# EasyEDA Pro project STM32F103RCT6核心板2.0.epro

# Schematic Schematic3
Create Date: 2024-05-28; Page Name: P1; Project Name: 飞行器协会; Schematic Name: Schematic3; Update Date: 2024-05-30; Company: 嘉立创EDA; Page Size: A4; Version: V1.0
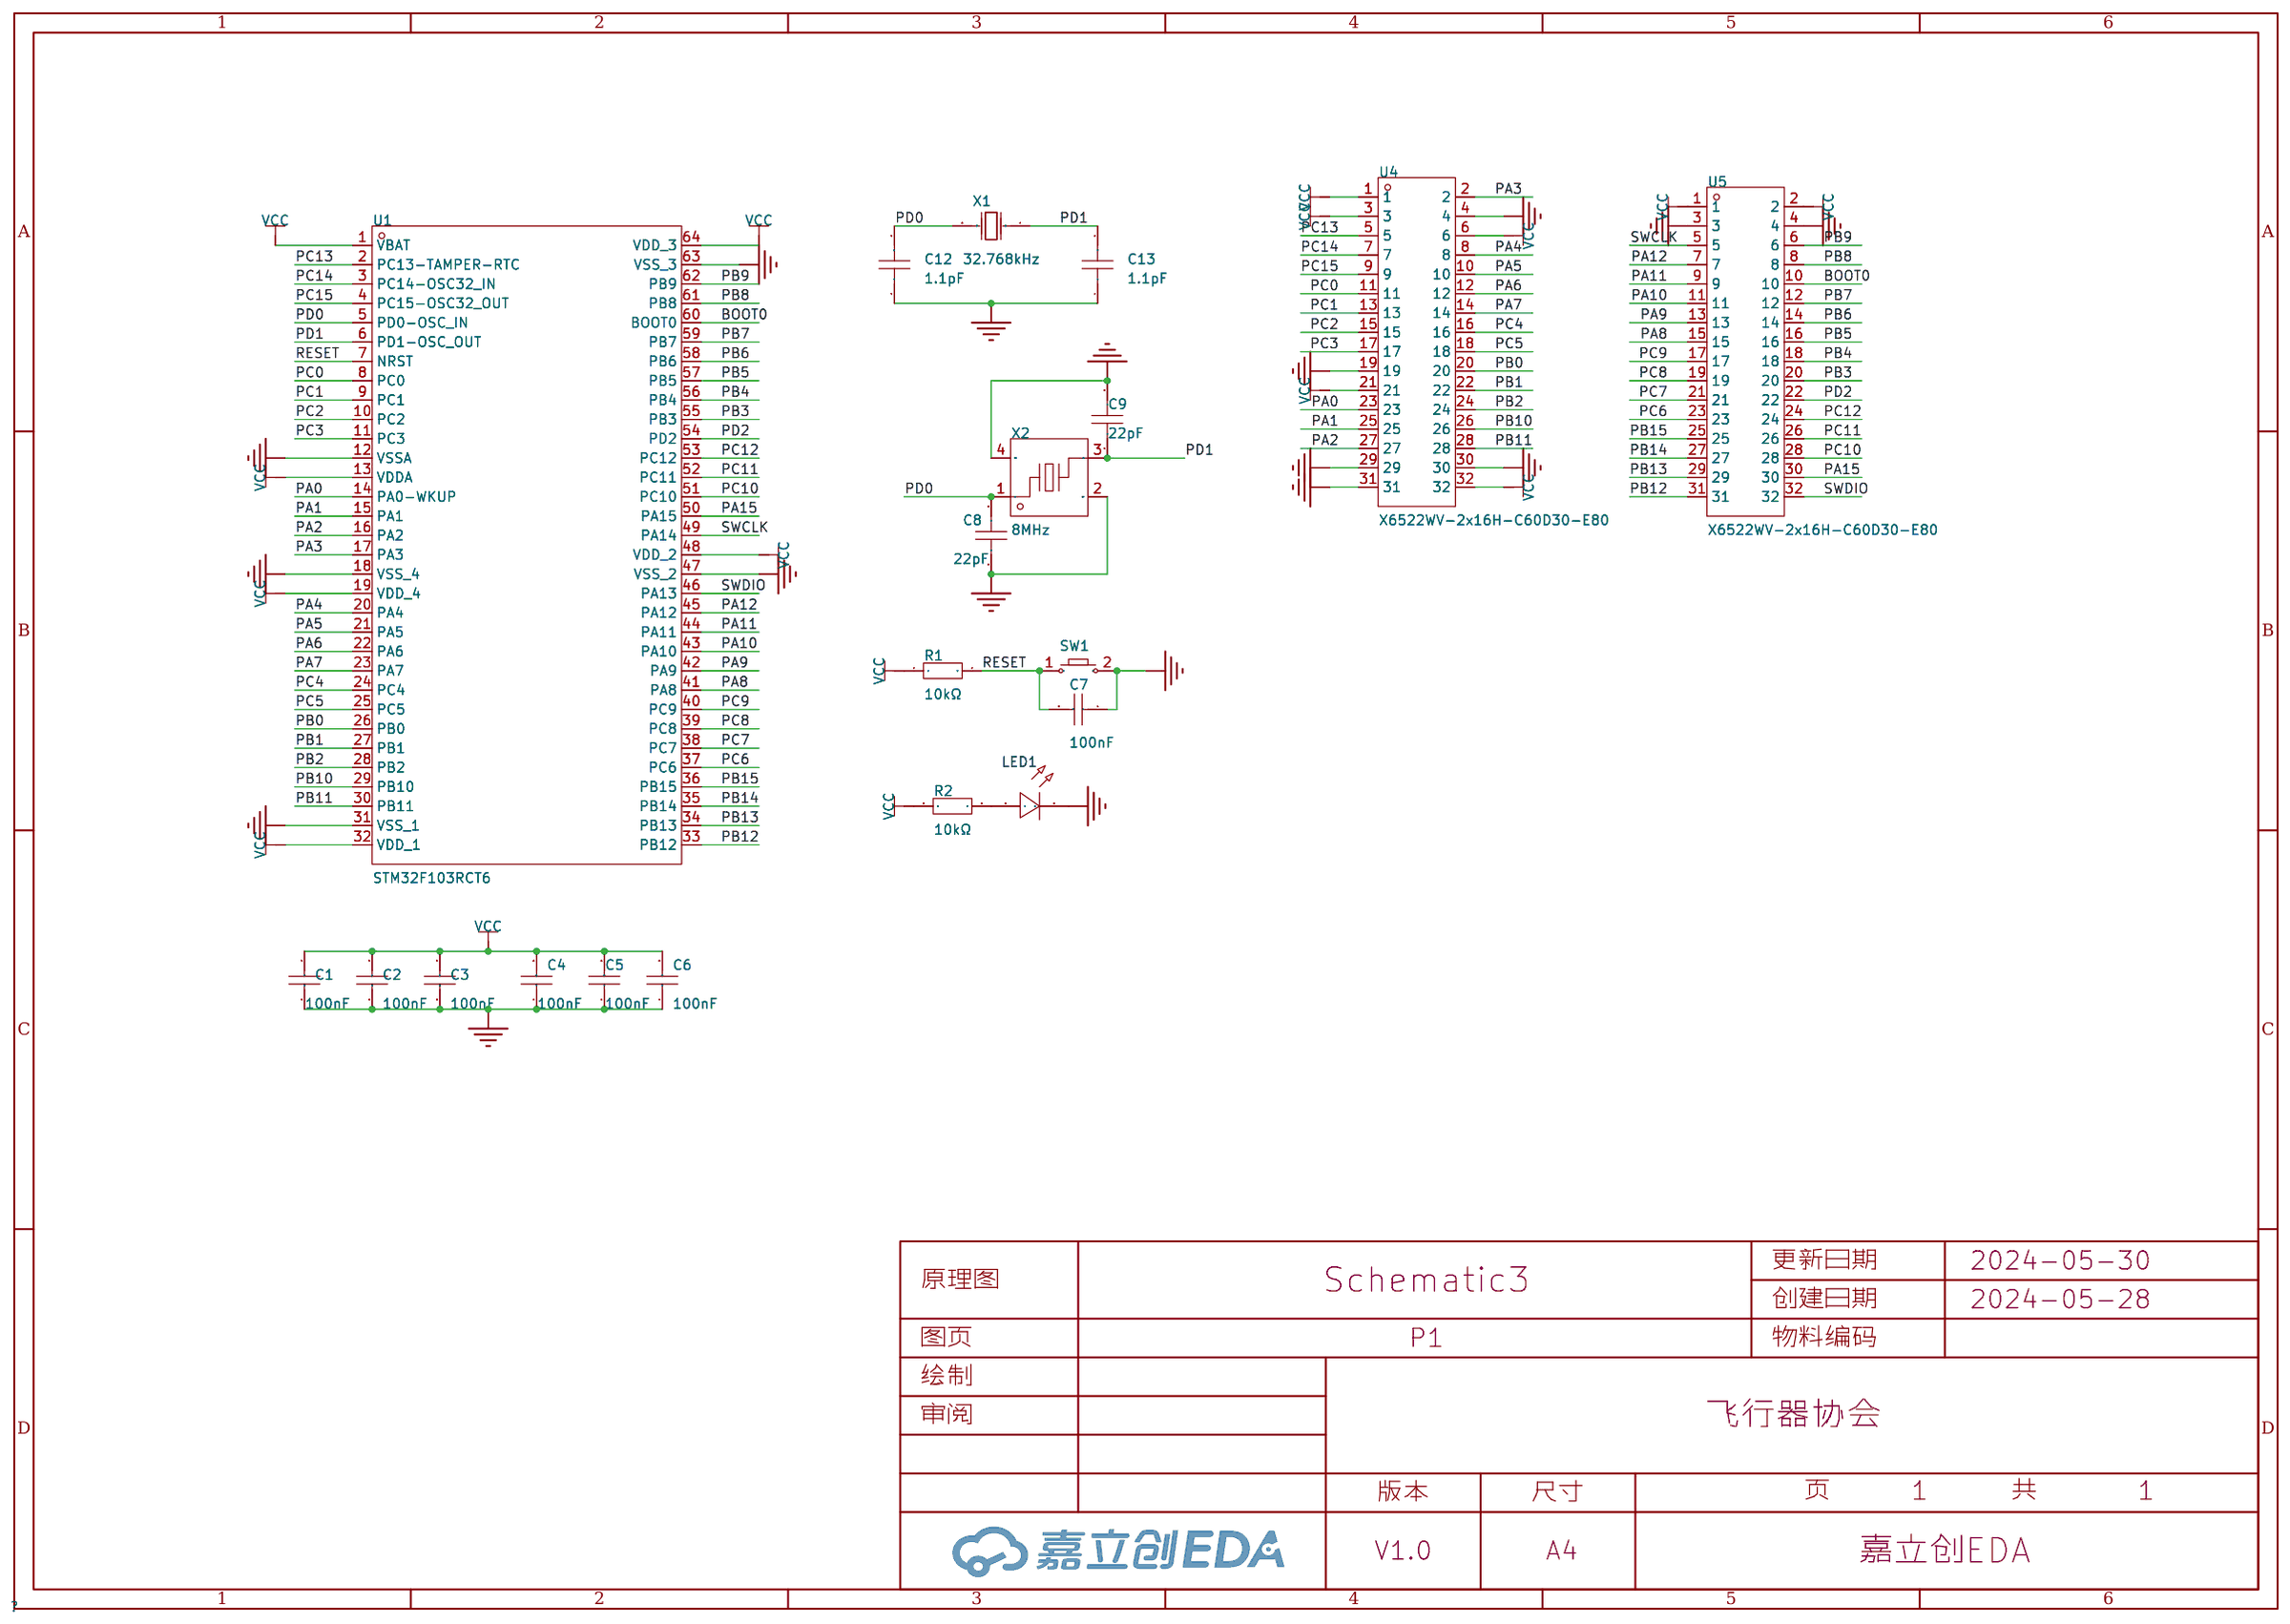
[diagram p0: schematic sheet]

## Parts
C1  100nF  [C0805]
C2  100nF  [C0805]
C3  100nF  [C0805]
C4  100nF  [C0805]
C5  100nF  [C0805]
C6  100nF  [C0805]
C7  100nF  [C0805]
C8  22pF  [C0805]
C9  22pF  [C0805]
C12  1.1pF  [C0805]
C13  1.1pF  [C0805]
LED1  -  [LED_0805]
R1  10kΩ  [R0805]
R2  10kΩ  [R0805]
SW1  -  [Key_SMD_3.6x6.1x2.5]
U1  STM32F103RCT6  [LQFP-64_L10.0-W10.0-P0.50-LS12.0-BL]
U4  X6522WV-2x16H-C60D30-E80  [HDR-TH_32P-P2.54-V-M-R2-C16-S2.54-3]
U5  X6522WV-2x16H-C60D30-E80  [HDR-TH_32P-P2.54-V-M-R2-C16-S2.54-3]
X1  32.768kHz  [OSC-TH_BD2.0-P0.70-D0.3]
X2  8MHz  [CRYSTAL-SMD_4P-L3.2-W2.5-BL]

## Library data of the parts
C1-C7 = CC0805KRX7R9BB104: 容值:100nF;精度:±10%;额定电压:50V;材质(温度系数):X7R;; LCSC Part Name: 100nF ±10% 50V; Supplier Part: C49678; Manufacturer: YAGEO(国巨); Supplier Footprint: 0805; JLCPCB Part Class: 基础库; Datasheet: https://atta.szlcsc.com/upload/public/pdf/source/20180224/C181747_15194369449651363981.pdf; Supplier: LCSC; Tolerance: ±10%; Voltage Rated: 50V; Temperature Coefficient: X7R
C8 C9 = 0805CG220J500NT: 容值:22pF;精度:±5%;额定电压:50V;材质(温度系数):C0G;; LCSC Part Name: 22pF ±5% 50V; Supplier Part: C24658; Manufacturer: FH(风华); Supplier Footprint: 0805; JLCPCB Part Class: 扩展库; Datasheet: https://atta.szlcsc.com/upload/public/pdf/source/20200305/C486355_26A10D38EF8C2A5C37091D0039909270.pdf; Supplier: LCSC; Tolerance: ±5%; Voltage Rated: 50V; Temperature Coefficient: C0G
C12 C13 = VJ0805D1R1CXPAC: 容值:1.1pF;额定电压:250V;材质(温度系数):C0G;; LCSC Part Name: 1.1pF 250V; Supplier Part: C2308480; Manufacturer: VISHAY(威世); Supplier Footprint: 0805; JLCPCB Part Class: 扩展库; Datasheet: https://atta.szlcsc.com/upload/public/pdf/source/20210429/BF4DD61B9900AD89BD8F9B4032699D18.pdf; Supplier: LCSC; Voltage Rated: 250V; Temperature Coefficient: C0G
LED1 = LED_0805-G: Supplier Footprint: 0805
R1 R2 = 0805W8F1002T5E_C17414: 电阻类型:厚膜电阻;阻值:10kΩ;精度:±1%;功率:125mW;最大工作电压:150V;温度系数:±100ppm/℃;; LCSC Part Name: 10kΩ ±1% 125mW 厚膜电阻; Supplier Part: C17414; Manufacturer: UNI-ROYAL(厚声); Manufacturer Part: 0805W8F1002T5E; Supplier Footprint: 0805; JLCPCB Part Class: 基础库; Datasheet: https://atta.szlcsc.com/upload/public/pdf/source/20200306/C422600_1E6D84923E4A46A82E41ADD87F860B5C.pdf; Supplier: LCSC; Type: 厚膜电阻; Tolerance: ±1%; Power(Watts): 125mW; Overload Voltage (Max): 150V; Temperature Coefficient: ±100ppm/℃; Operating Temperature Range: -55℃~+155℃
SW1 = Key_SMD_3.6x6.1x2.5: Supplier Footprint: SMD
U1 = STM32F103RCT6: CPU内核:ARM Cortex-M3;CPU最大主频:72MHz;工作电压范围:2V~3.6V;程序存储容量:256KB;程序存储器类型:FLASH;RAM总容量:48KB;GPIO端口数量:51;; Supplier Part: C8323; Manufacturer: ST(意法半导体); Supplier Footprint: LQFP-64(10x10); JLCPCB Part Class: Extended Part; Datasheet: https://atta.szlcsc.com/upload/public/pdf/source/20180207/C88442_15179953708671359491.pdf; Supplier: LCSC; CPU Core: ARM Cortex-M3; CPU Maximum Speed: 72MHz; Operating Voltage Range: 2V~3.6V; Program Storage Size: 256KB; Program Memory Type: FLASH; RAM Size: 48KB; GPIO Ports Number: 51; ADC (Bit): 12bit; DAC (Bit): 12bit; Universal Serial Bus: 有; Peripheral/Function: DMA；片载温度传感器；PWM; Watchdog: 有; Infrared Data Association: 有; Low-Voltage Detect: 有; Direct Memory Access: 有; Internal Oscillator: 有; Operating Temperature Range: -40℃~+85℃
U4 U5 = X6522WV-2x16H-C60D30-E80: 插针结构:2x16P;间距:2.54mm;行距:2.54mm;圆针/方针:方针;安装类型:-;排数:双排;总PIN位数:32P;额定电流:3A;额定电压:250V;配合针长度:6mm;塑高:2.5mm;端接针长度:3mm;触头材质:黄铜;触头镀层:金;工作温度范围:-40℃~+105℃;焊接温度(最大值):260℃;颜色:黑色;; LCSC Part Name: 2x16P 间距:2.54mm 方针; Supplier Part: C5242090; Manufacturer: XKB Connection(中国星坤); Supplier Footprint: 插件,P=2.54mm; JLCPCB Part Class: Extended Part; Datasheet: https://atta.szlcsc.com/upload/public/pdf/source/20221103/23C5907AD205635BEC14B32D152B61D5.pdf; Supplier: LCSC; Pin Structure: 2x16P; Pitch: 2.54mm; Row Spacing: 2.54mm; Circluar Pins/Square Pins: 方针; Number of Rows: 双排; Number of Pins: 32P; Current Rating (Max): 3A; Voltage Rating (Max): 250V; Length of Mating Pin: 6mm; Insulation Height: 2.5mm; Length of End Connection Pin: 3mm; Contact Material: 黄铜; Contact Plating: 金; Operating Temperature Range: -40℃~+105℃; Soldering Temperature(Max): 260℃; Color: 黑色
X1 = DT-26 32.768KHz: 晶振类型:-;频率:-;外接负载电容:-;; LCSC Part Name: 32.768KHz 12.5PF 20ppm; Supplier Part: C93229; Manufacturer: KDS(大真空); Supplier Footprint: DT-26; JLCPCB Part Class: 扩展库; Datasheet: https://atta.szlcsc.com/upload/public/pdf/source/20170103/1483440003252.pdf; Supplier: LCSC
X2 = 3225 8M 20PF 10PPM: 晶振类型:-;频率:8MHz;常温频差:±10ppm;外接负载电容:20pF;频率稳定度(全温):±30ppm;; LCSC Part Name: 8MHz ±10ppm 20pF; Supplier Part: C5181477; Manufacturer: SST(索斯特); Supplier Footprint: SMD3225-4P; JLCPCB Part Class: 扩展库; Datasheet: https://atta.szlcsc.com/upload/public/pdf/source/20220927/9FEBDC685A33E51679C27FBCC47D4DBA.pdf; Supplier: LCSC; Normal temperature Frequency Tolerance: ±10ppm; External load capacitor: 20pF; Frequency Stability(Full temperature range): ±30ppm; Operating Temperature: -40℃~+80℃

## Nets
GND: C1.1 C2.1 C3.1 C4.1 C5.1 C6.1 C7.1 C8.1 C9.2 C12.1 C13.1 LED1.1(C) SW1.2 U1.12(VSSA) U1.18(VSS_4) U1.31(VSS_1) U1.47(VSS_2) U1.63(VSS_3) U4.4 U4.19 U4.29 U4.30 U4.31 U5.3 U5.4 X2.2(GND) X2.4(GND)
VCC: C1.2 C2.2 C3.2 C4.2 C5.2 C6.2 R1.1 R2.1 U1.1(VBAT) U1.13(VDDA) U1.19(VDD_4) U1.32(VDD_1) U1.48(VDD_2) U1.64(VDD_3) U4.1 U4.3 U4.6 U4.21 U4.32 U5.1 U5.2
BOOT0: U1.60(BOOT0) U5.10
PA0: U1.14(PA0-WKUP) U4.23
PA1: U1.15(PA1) U4.25
PA2: U1.16(PA2) U4.27
PA3: U1.17(PA3) U4.2
PA4: U1.20(PA4) U4.8
PA5: U1.21(PA5) U4.10
PA6: U1.22(PA6) U4.12
PA7: U1.23(PA7) U4.14
PA8: U1.41(PA8) U5.15
PA9: U1.42(PA9) U5.13
PA10: U1.43(PA10) U5.11
PA11: U1.44(PA11) U5.9
PA12: U1.45(PA12) U5.7
PA15: U1.50(PA15) U5.30
PB0: U1.26(PB0) U4.20
PB1: U1.27(PB1) U4.22
PB2: U1.28(PB2) U4.24
PB3: U1.55(PB3) U5.20
PB4: U1.56(PB4) U5.18
PB5: U1.57(PB5) U5.16
PB6: U1.58(PB6) U5.14
PB7: U1.59(PB7) U5.12
PB8: U1.61(PB8) U5.8
PB9: U1.62(PB9) U5.6
PB10: U1.29(PB10) U4.26
PB11: U1.30(PB11) U4.28
PB12: U1.33(PB12) U5.31
PB13: U1.34(PB13) U5.29
PB14: U1.35(PB14) U5.27
PB15: U1.36(PB15) U5.25
PC0: U1.8(PC0) U4.11
PC1: U1.9(PC1) U4.13
PC2: U1.10(PC2) U4.15
PC3: U1.11(PC3) U4.17
PC4: U1.24(PC4) U4.16
PC5: U1.25(PC5) U4.18
PC6: U1.37(PC6) U5.23
PC7: U1.38(PC7) U5.21
PC8: U1.39(PC8) U5.19
PC9: U1.40(PC9) U5.17
PC10: U1.51(PC10) U5.28
PC11: U1.52(PC11) U5.26
PC12: U1.53(PC12) U5.24
PC13: U1.2(PC13-TAMPER-RTC) U4.5
PC14: U1.3(PC14-OSC32_IN) U4.7
PC15: U1.4(PC15-OSC32_OUT) U4.9
PD0: C8.2 C12.2 U1.5(PD0-OSC_IN) X1.2(OSC2) X2.1
PD1: C9.1 C13.2 U1.6(PD1-OSC_OUT) X1.1(OSC1) X2.3
PD2: U1.54(PD2) U5.22
RESET: C7.2 R1.2 SW1.1 U1.7(NRST)
SWCLK: U1.49(PA14) U5.5
SWDIO: U1.46(PA13) U5.32
$1N2509: LED1.2(A) R2.2

# Board PCB13
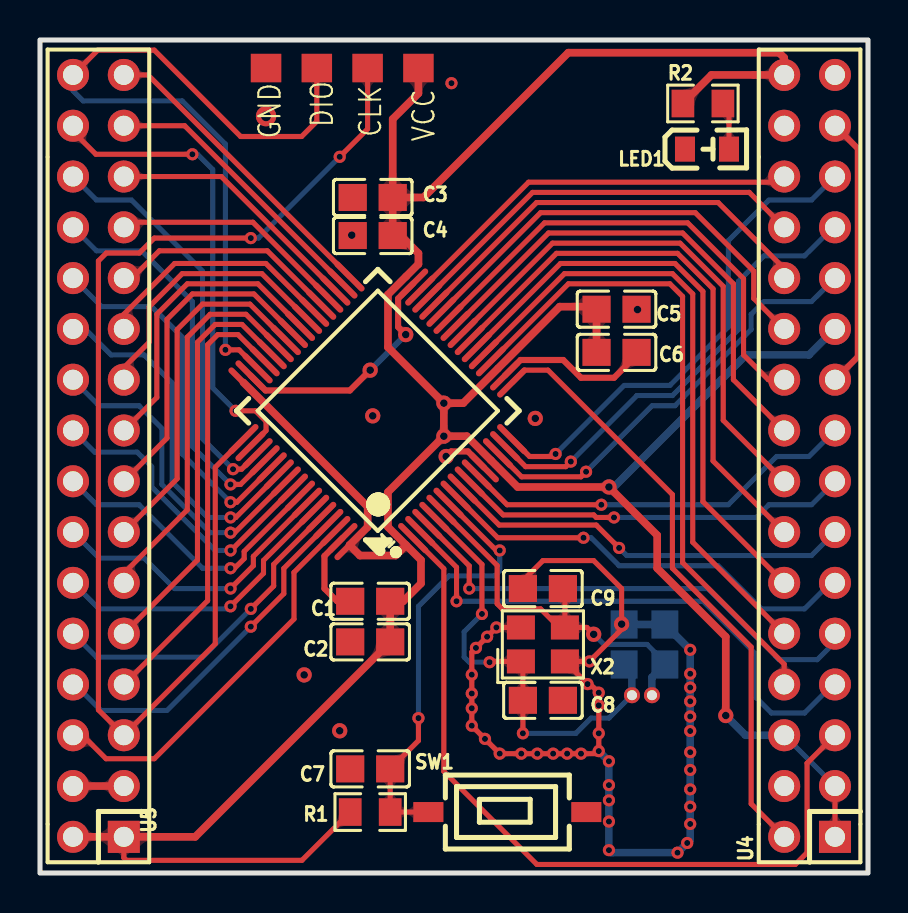
[diagram p1: board, top side]
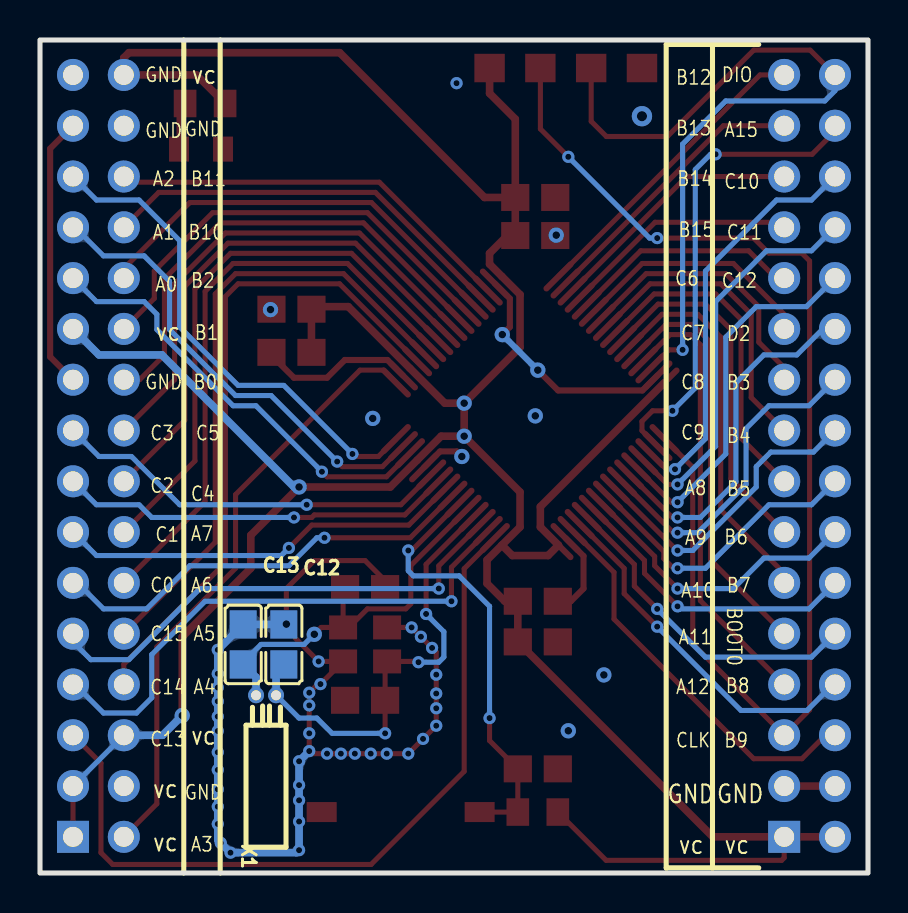
[diagram p2: board, bottom side, seen from below]

Outline 41.4 x 41.66 mm; copper layers: Top Layer, Bottom Layer. Coordinates in mm from the lower left corner of the outline.
Outline path: rectangle 0,41.66 41.4,0
Stack: Top Layer 0.035mm / Dielectric1 1.51mm FR4 er 4.5 / Bottom Layer 0.035mm

## Design rules (mm)
template: JLCPCB Capability(Two Layers Board)
spacing copperThickness1oz (default): track to track 0.102, other pairs 0.152 to 0.3
spacing copperThickness2oz: track to track 0.203, other pairs 0.152 to 0.3
track width copperThickness1oz (default): min 0.127, default 0.254, max 2.54
track width copperThickness2oz: min 0.203, default 0.254, max 2.54
differential pair differentialPair (default): width min 0.127, default 0.254, max 2.54; gap min 0.152, default 0.152
via viaSize (default): diameter min 0.5, default 0.61, max 10; hole min 0.3, default 0.305, max 6.3

## Placement (name value [footprint] x y rotation side)
C1  100nF  [C0805]  16.51 13.59 0 top
C2  100nF  [C0805]  16.51 11.56 0 top
C3  100nF  [C0805]  16.64 33.78 0 top
C4  100nF  [C0805]  16.64 31.88 0 top
C5  100nF  [C0805]  28.83 28.19 180 top
C6  100nF  [C0805]  28.83 26.03 180 top
C7  100nF  [C0805]  16.51 5.21 0 top
C8  22pF  [C0805]  25.15 8.64 180 top
C9  22pF  [C0805]  25.15 14.22 180 top
C12  1.1pF  [C0805]  29.21 11.43 270 bottom
C13  1.1pF  [C0805]  31.24 11.43 270 bottom
LED1  -  [LED_0805]  33.4 36.19 0 top
NOREF  -  [Pad_e179]  11.3 40.25 0 top
NOREF#2  -  [Pad_e178]  18.92 40.25 0 top
NOREF#3  -  [Pad_e157]  16.38 40.25 0 top
NOREF#4  -  [Pad_e164]  13.84 40.25 0 top
R1  10kΩ  [R0805]  16.51 3.05 0 top
R2  10kΩ  [R0805]  33.15 38.48 0 top
SW1  -  [Key_SMD_3.6x6.1x2.5]  23.37 3.05 0 top
U1  STM32F103RCT6  [LQFP-64_L10.0-W10.0-P0.50-LS12.0-BL]  16.89 23.11 45 top
U4  X6522WV-2x16H-C60D30-E80  [HDR-TH_32P-P2.54-V-M-R2-C16-S2.54-3]  38.48 20.86 90 top
U5  X6522WV-2x16H-C60D30-E80  [HDR-TH_32P-P2.54-V-M-R2-C16-S2.54-3]  2.92 20.86 90 top
X1  32.768kHz  [OSC-TH_BD2.0-P0.70-D0.3]  30.1 8.89 90 bottom
X2  8MHz  [CRYSTAL-SMD_4P-L3.2-W2.5-BL]  25.15 11.43 0 top

## Footprints (pads in the part's own frame, mm; a bottom-side part is the same pattern mirrored in y, then rotated)
C0805
  rect 1.41x1.35 smd: 1(-1,0) 2(1,0)
CRYSTAL-SMD_4P-L3.2-W2.5-BL
  rect 1.4x1.2 smd: 1(-1.1,-0.85) 2(1.1,-0.85) 3(1.1,0.85) 4(-1.1,0.85)
HDR-TH_32P-P2.54-V-M-R2-C16-S2.54-3
  rect 1.6x1.6 hole 1: 1(-19.05,-1.27)
  round 1.6 hole 1: 2(-19.05,1.27) 3(-16.51,-1.27) 4(-16.51,1.27) 5(-13.97,-1.27) 6(-13.97,1.27) 7(-11.43,-1.27) 8(-11.43,1.27) 9(-8.89,-1.27) 10(-8.89,1.27) 11(-6.35,-1.27) 12(-6.35,1.27) 13(-3.81,-1.27) 14(-3.81,1.27) 15(-1.27,-1.27) 16(-1.27,1.27) 17(1.27,-1.27) 18(1.27,1.27) 19(3.81,-1.27) 20(3.81,1.27) 21(6.35,-1.27) 22(6.35,1.27) 23(8.89,-1.27) 24(8.89,1.27) 25(11.43,-1.27) 26(11.43,1.27) 27(13.97,-1.27) 28(13.97,1.27) 29(16.51,-1.27) 30(16.51,1.27) 31(19.05,-1.27) 32(19.05,1.27)
Key_SMD_3.6x6.1x2.5
  rect 1.501x1.001 smd: 1(-3.95,0) 2(3.95,0)
LED_0805
  rect 1x1.25 smd: 1(-1.15,0.005) 2(1.05,0.005)
LQFP-64_L10.0-W10.0-P0.50-LS12.0-BL
  oval 0.3x2 smd: 1(-3.75,-5.75) 2(-3.25,-5.75) 3(-2.75,-5.75) 4(-2.25,-5.75) 5(-1.75,-5.75) 6(-1.25,-5.75) 7(-0.75,-5.75) 8(-0.25,-5.75) 9(0.25,-5.75) 10(0.75,-5.75) 11(1.25,-5.75) 12(1.75,-5.75) 13(2.25,-5.75) 14(2.75,-5.75) 15(3.25,-5.75) 16(3.75,-5.75) 33(3.75,5.75) 34(3.25,5.75) 35(2.75,5.75) 36(2.25,5.75) 37(1.75,5.75) 38(1.25,5.75) 39(0.75,5.75) 40(0.25,5.75) 41(-0.25,5.75) 42(-0.75,5.75) 43(-1.25,5.75) 44(-1.75,5.75) 45(-2.25,5.75) 46(-2.75,5.75) 47(-3.25,5.75) 48(-3.75,5.75)
  oval 2x0.3 smd: 17(5.75,-3.75) 18(5.75,-3.25) 19(5.75,-2.75) 20(5.75,-2.25) 21(5.75,-1.75) 22(5.75,-1.25) 23(5.75,-0.75) 24(5.75,-0.25) 25(5.75,0.25) 26(5.75,0.75) 27(5.75,1.25) 28(5.75,1.75) 29(5.75,2.25) 30(5.75,2.75) 31(5.75,3.25) 32(5.75,3.75) 49(-5.75,3.75) 50(-5.75,3.25) 51(-5.75,2.75) 52(-5.75,2.25) 53(-5.75,1.75) 54(-5.75,1.25) 55(-5.75,0.75) 56(-5.75,0.25) 57(-5.75,-0.25) 58(-5.75,-0.75) 59(-5.75,-1.25) 60(-5.75,-1.75) 61(-5.75,-2.25) 62(-5.75,-2.75) 63(-5.75,-3.25) 64(-5.75,-3.75)
OSC-TH_BD2.0-P0.70-D0.3
  round 0.8 hole 0.5: 1(0,0.5) 2(0,-0.5)
Pad_e157
  custom 1.524x1.425 smd: 65(0,0)
Pad_e164
  custom 1.524x1.425 smd: 65(0,0)
Pad_e178
  custom 1.524x1.425 smd: 65(0,0)
Pad_e179
  custom 1.524x1.425 smd: 65(0,0)
R0805
  rect 1.133x1.377 smd: 1(-1,0) 2(1,0)

## Nets
As in the schematic, except:
GND: C1.1 C2.1 C3.1 C4.1 C5.1 C6.1 C7.1 C8.1 C9.2 C12.1 C13.1 LED1.1 NOREF.65 SW1.2 U1.12 U1.18 U1.31 U1.47 U1.63 U4.4 U4.19 U4.29 U4.30 U4.31 U5.3 U5.4 X2.2 X2.4
VCC: C1.2 C2.2 C3.2 C4.2 C5.2 C6.2 NOREF#2.65 R1.1 R2.1 U1.1 U1.13 U1.19 U1.32 U1.48 U1.64 U4.1 U4.3 U4.6 U4.21 U4.32 U5.1 U5.2
SWCLK: NOREF#3.65 U1.49 U5.5
SWDIO: NOREF#4.65 U1.46 U5.32

## Via types
v1: diameter 0.762, hole 0.381, Top Layer to Bottom Layer, 15 vias
v2: diameter 0.61, hole 0.305, Top Layer to Bottom Layer, 69 vias
v3: diameter 1.016, hole 0.508, Top Layer to Bottom Layer, 1 via

## Routing (per net, layer and track width the routed paths; a pad name or vN(x,y) marks a point on that pad's centre or on a via; arc(x,y) is an arc through that point)
GND: length 96.7
  Top Layer w0.254: X2.4 v2(22.82,12.28) v2(22.36,11.81) 21.59,11.05 v2(21.59,9.92) v2(21.59,8.98) v2(21.59,8.24) v2(21.59,7.37) v2(22.25,6.71) v2(22.99,5.97) v2(24.06,5.97) v2(24.86,5.97) v2(25.66,5.97) v2(26.36,5.97) v2(27.05,5.97) 27.81,5.97 v2(27.94,6.1) v2(27.94,6.98) v2(27.94,8.38) v2(27.94,9.02) 27.51,9.45 v2(27.38,9.45) X2.2 v2(27.47,10.58) 29.08,12.19 29.08,14.22 27.69,15.62 25.15,15.62 24.13,14.6 24.13,14.24 C9.2
  Top Layer w0.305: C6.1 29.83,25.89 28.7,24.76 27.05,24.76 26.16,25.65 24.03,25.65 U1.18 ; 22.19,20.29 21.4,21.08 20.56,21.08 v1(20.31,20.83) ; v1(16.51,25.15) 15.49,24.13 11.28,24.13 U1.47 ; U4.19 40.89,25.81 40.89,36.23 U4.29 ; v1(18.29,26.92) 17.91,27.3 17.91,28.73 U1.31 ; U1.63 14.22,15.85 14.22,14.22 14.86,13.59 C1.1
  Top Layer w0.381: U5.4 U5.3
  Bottom Layer w0.305: v1(16.51,25.15) v1(18.29,26.92)
  Bottom Layer w0.381: C12.1 C13.1 v2(32.51,11.16) v2(32.51,9.96) v2(32.51,9.27) v2(32.51,8.59) v2(32.51,7.83) v2(32.51,7.1) v2(32.51,6.04) v2(32.51,5.16) v2(32.51,4.18) v2(32.51,3.32) v2(32.51,2.45) 32.51,1.65 v2(31.88,1.02) 28.57,1.02 v2(28.45,1.14) v2(28.45,2.57) v2(28.45,3.64) v2(28.45,4.4) v2(28.45,5.59) v2(27.94,6.1)
  vias: v1(13.21,9.91) v1(14.99,7.11) v1(15.59,31.9) v1(16.64,22.86) v1(24.76,22.73) v1(29.08,12.45) v1(29.88,28.17) v2(20.57,39.5) v2(21.8,11.26) v2(32.36,1.5) v3(11.3,37.85)
VCC: length 170.5
  Top Layer w0.254: U5.1 4.19,0.76 4.32,0.63 13.1,0.63 R1.1 ; U4.1 U4.3
  Top Layer w0.381: v1(34.29,7.87) 34.29,11.81 30.86,15.24 30.86,16.89 v1(28.45,19.3) 23.88,19.3 22.55,20.64 21.34,21.84 v1(20.19,21.84) ; U5.2 U5.1 7.76,1.81 C2.2 C1.2 18.16,13.59 19.05,14.48 19.05,15.65 U1.1 ; C6.2 C5.2 27.7,28.32 25.99,28.32 22.9,25.23 21.16,23.49 v1(20.19,23.49) ; U1.1 17.78,15.87 16,15.87 U1.64 16.38,17.3 16.38,18.32 U1.48 ; U1.1 17.4,17.3 17.4,19.05 v1(20.19,21.84) ; v1(20.19,23.49) v1(20.19,21.84) ; v1(20.19,23.49) 17.4,26.29 17.4,28.93 U1.32 18.92,30.45 18.92,30.99 18.03,31.88 C4.2 C3.2 ; C3.2 19.18,33.78 26.42,41.02 36.96,41.02 37.21,40.77 U4.32 33.57,39.91 R2.1 ; C3.2 17.64,37.7 18.92,38.99 NOREF#2.65
  Bottom Layer w0.254: U4.3 U4.6
  Bottom Layer w0.381: U4.21 38.45,25.91 35.31,25.91 28.7,19.3 v1(28.45,19.3) ; v1(34.29,7.87) 35.28,6.89 U4.6
BOOT0: length 16.4
  Top Layer w0.254: v2(10.54,13.21) 11.68,14.35 11.68,15.43 U1.60
  Bottom Layer w0.254: v2(10.54,13.21) 8.13,10.79 2.82,10.79 U5.10
PA0: length 21.9
  Top Layer w0.254: 22.9,20.99 24.08,19.81 27.05,19.81 v2(27.31,20.07)
  Bottom Layer w0.254: v2(27.31,20.07) 30.61,23.37 31.75,23.37 35.56,27.18 35.56,27.94 36.19,28.57 38.58,28.57 U4.23
PA1: length 23.3
  Top Layer w0.254: v2(26.54,20.57) 26.29,20.32 24.28,20.32 U1.15
  Bottom Layer w0.254: U4.25 39.65,32.29 38.23,30.86 36.19,30.86 34.93,29.59 34.93,27.18 31.62,23.88 29.84,23.88 v2(26.54,20.57)
PA2: length 24.8
  Top Layer w0.254: v2(25.78,20.95) 25.65,20.83 24.48,20.83 U1.16
  Bottom Layer w0.254: U4.27 38.58,33.65 36.45,33.65 34.42,31.62 34.42,27.3 31.5,24.38 29.21,24.38 v2(25.78,20.95)
PA3: length 30.3
  Top Layer w0.254: U4.2 35.56,3.46 35.56,11.3 31.62,15.24 31.62,18.92 25.4,25.15 24.23,25.15 U1.17
PA4: length 33
  Top Layer w0.254: 22.55,25.59 26.42,29.46 31.5,29.46 32.13,28.83 32.13,15.52 37.21,10.44 U4.8
PA5: length 31.4
  Top Layer w0.254: U4.10 32.64,16.54 32.64,28.96 31.62,29.97 26.22,29.97 22.19,25.94
PA6: length 29.9
  Top Layer w0.254: U1.22 26.02,30.48 31.75,30.48 33.15,29.08 33.15,18.57 U4.12
PA7: length 28.3
  Top Layer w0.254: U1.23 25.83,30.99 31.88,30.99 33.66,29.21 33.66,20.6 U4.14
PA8: length 16.6
  Top Layer w0.254: 12.65,27 10.7,28.96 7.62,28.96 6.35,27.69 6.35,21.75 U5.15
PA9: length 17.9
  Top Layer w0.254: U5.13 6.86,19.72 6.86,27.18 8.13,28.45 10.5,28.45 U1.42
PA10: length 19.3
  Top Layer w0.254: U1.43 10.3,27.94 8.51,27.94 7.37,26.8 7.37,18.16 4.19,14.99 U5.11
PA11: length 20.8
  Top Layer w0.254: U5.9 7.87,15.65 7.87,26.54 8.76,27.43 10.1,27.43 11.59,25.94
PA12: length 22.3
  Top Layer w0.254: U5.7 8.38,13.62 8.38,26.42 8.89,26.92 9.9,26.92 11.23,25.59
PA15: length 23.9
  Top Layer w0.254: v2(9.78,23.11) 10.77,23.11 11.3,22.58 11.3,22.12 U1.50 ; v2(7.62,35.94) 2.79,35.94 1.65,37.08 U5.30
  Bottom Layer w0.254: v2(9.78,23.11) 8.64,24.26 8.64,35.18 7.87,35.94 v2(7.62,35.94)
PB0: length 24.3
  Top Layer w0.254: U1.26 25.23,32.51 32.38,32.51 35.18,29.72 35.18,25.91 36.42,24.67 U4.20
PB1: length 22.4
  Top Layer w0.254: U1.27 25.03,33.02 32.77,33.02 35.69,30.1 35.69,28.73 U4.22
PB2: length 21.5
  Top Layer w0.254: U4.24 37.21,30.23 33.91,33.53 24.83,33.53 U1.28
PB3: length 16.5
  Top Layer w0.254: U1.55 9.73,17.02 v2(9.53,17.02)
  Bottom Layer w0.254: U5.20 2.95,23.37 4.95,23.37 6.1,22.22 6.1,19.43 8.51,17.02 v2(9.53,17.02)
PB4: length 15.4
  Top Layer w0.254: 12.65,19.22 9.55,16.13 v2(9.53,16.13)
  Bottom Layer w0.254: v2(9.53,16.13) 8.76,16.13 5.59,19.3 5.59,20.32 4.86,21.05 2.73,21.05 U5.18
PB5: length 14.9
  Top Layer w0.254: U1.57 10.21,16.08 10.21,15.72 9.73,15.24 v2(9.53,15.24)
  Bottom Layer w0.254: U5.16 2.82,18.41 4.95,18.41 8.13,15.24 v2(9.53,15.24)
PB6: length 14.9
  Top Layer w0.254: U1.58 10.67,15.83 10.67,15.37 v2(9.53,14.22)
  Bottom Layer w0.254: v2(9.53,14.22) 6.73,14.22 5.21,15.75 2.95,15.75 U5.14
PB7: length 15
  Top Layer w0.254: v2(9.53,13.33) 11.18,14.99 11.18,15.63 U1.59
  Bottom Layer w0.254: U5.12 2.95,13.21 9.4,13.21 v2(9.53,13.33)
PB8: length 17.9
  Top Layer w0.254: v2(10.54,12.32) 12.19,13.97 12.19,15.23 U1.61
  Bottom Layer w0.254: U5.8 1.75,9.43 3.05,8.13 6.35,8.13 v2(10.54,12.32)
PB9: length 19.7
  Top Layer w0.254: U1.62 12.7,15.03 12.7,12.7 5.72,5.71 3.3,5.71 2.13,6.89 U5.6
PB10: length 20.8
  Top Layer w0.254: U4.26 35.46,34.04 24.63,34.04 U1.29
PB11: length 20.6
  Top Layer w0.254: U1.30 24.43,34.54 36.93,34.54 U4.28
PB12: length 15.5
  Top Layer w0.254: U5.31 5.4,39.91 U1.33
PB13: length 14.2
  Top Layer w0.254: U1.34 7.23,37.37 U5.29
PB14: length 12.9
  Top Layer w0.254: U5.27 9.07,34.83 U1.35
PB15: length 11.9
  Top Layer w0.254: U5.25 4.44,32.54 10.64,32.54 U1.36
PC0: length 21.9
  Top Layer w0.254: v2(27.18,16.76) 22.89,16.76 U1.8
  Bottom Layer w0.254: U4.11 39.53,14.51 38.23,13.21 36.07,13.21 33.91,15.37 28.96,15.37 27.56,16.76 v2(27.18,16.76)
PC1: length 20.5
  Top Layer w0.254: v2(28.96,16.26) 27.81,17.4 22.96,17.4 21.13,19.22
  Bottom Layer w0.254: U4.13 38.58,15.87 29.34,15.87 v2(28.96,16.26)
PC2: length 19.8
  Top Layer w0.254: U1.10 23.16,17.91 27.69,17.91 27.81,17.78 v2(28.7,17.78)
  Bottom Layer w0.254: v2(28.7,17.78) 35.81,17.78 36.45,18.41 38.58,18.41 U4.15
PC3: length 20.1
  Top Layer w0.254: v2(28.07,18.41) 23.36,18.41 U1.11
  Bottom Layer w0.254: v2(28.07,18.41) 34.42,18.41 36.83,20.83 38.45,20.83 U4.17
PC4: length 26.8
  Top Layer w0.254: 21.13,27 25.63,31.5 32,31.5 34.16,29.34 34.16,22.64 U4.16
PC5: length 25.3
  Top Layer w0.254: U1.25 25.43,32 32.13,32 34.67,29.46 34.67,24.67 U4.18
PC6: length 11.6
  Top Layer w0.254: U1.37 11.37,31.11 5.97,31.11 4.6,29.75 U5.23
PC7: length 12.3
  Top Layer w0.254: U5.21 4.19,27.94 6.73,30.48 11.29,30.48 U1.38
PC8: length 13.7
  Top Layer w0.254: U1.39 11.09,29.97 7.11,29.97 5.46,28.32 5.46,26.54 4.19,25.27 U5.19
PC9: length 15.2
  Top Layer w0.254: U1.40 10.89,29.46 7.37,29.46 5.84,27.94 5.84,23.78 U5.17
PC10: length 20.5
  Top Layer w0.254: v2(9.65,20.19) 10.08,20.19 10.88,20.99
  Bottom Layer w0.254: U5.28 2.82,33.65 4.57,33.65 8.13,30.1 8.13,21.72 v2(9.65,20.19)
PC11: length 19.6
  Top Layer w0.254: 11.23,20.64 10.03,19.43 v2(9.53,19.43)
  Bottom Layer w0.254: U5.26 2.82,31.11 5.08,31.11 7.62,28.57 7.62,21.34 v2(9.53,19.43)
PC12: length 18.7
  Top Layer w0.254: 11.59,20.29 9.84,18.54 v2(9.53,18.54)
  Bottom Layer w0.254: v2(9.53,18.54) 7.11,20.95 7.11,26.8 5.59,28.32 3.08,28.32 U5.24
PC13: length 39.1
  Top Layer w0.254: U4.5 38.35,5.49 38.35,1.02 37.76,0.43 24.85,0.43 20.19,5.08 20.19,15.22 U1.2
PC14: length 27.4
  Top Layer w0.254: U1.3 20.83,15.29 v2(20.83,13.59)
  Bottom Layer w0.254: v2(20.83,13.59) 33.15,13.59 35.81,10.92 35.81,8.76 36.58,8 38.23,8 39.65,9.43 U4.7
PC15: length 24.6
  Top Layer w0.254: v2(21.46,14.22) 21.46,15.36 U1.4
  Bottom Layer w0.254: v2(21.46,14.22) 33.4,14.22 36.96,10.67 38.86,10.67 39.75,11.56 U4.9
PD0: length 22.9
  Top Layer w0.254: v2(22.1,12.95) 22.1,15.43 U1.5 ; v2(22.48,10.54) 22.52,10.58 X2.1 24.15,10.48 C8.2 v2(24.15,6.98)
  Bottom Layer w0.254: X1.2 29.59,8.89 28.45,7.75 27.56,7.75 26.8,6.98 v2(24.15,6.98) ; v2(22.48,10.54) 21.46,10.54 21.21,10.79 21.21,12.06 v2(22.1,12.95)
  Bottom Layer w0.381: C12.2 29.6,10.04 X1.2
PD1: length 19.4
  Top Layer w0.254: U1.6 22.86,15.38 22.86,13.46 23.11,13.21 25.03,13.21 25.96,12.28 X2.3 ; X2.3 27.34,12.28 v1(27.69,11.94) ; X2.3 26.25,14.12 C9.1
  Bottom Layer w0.254: v1(27.69,11.94) 28.19,11.43 30.35,11.43 31.24,10.54 C13.2
  Bottom Layer w0.381: C13.2 30.6,9.79 X1.1
PD2: length 18
  Top Layer w0.254: v2(9.53,17.78) 9.79,17.78 U1.54
  Bottom Layer w0.254: U5.22 2.26,27.21 3.56,25.91 5.21,25.91 6.6,24.51 6.6,19.56 8.38,17.78 v2(9.53,17.78)
RESET: length 22.1
  Top Layer w0.254: SW1.1 R1.2 C7.2 18.92,6.62 v2(18.92,7.75) ; U1.7 22.82,16.13 v2(22.99,16.13)
  Bottom Layer w0.254: v2(18.92,7.75) 18.92,13.33 20.45,14.86 22.73,14.86 22.99,15.11 v2(22.99,16.13)
SWCLK: length 60.8
  Top Layer w0.254: U1.49 8.76,20.29 8.76,11.46 U5.5 2.92,8.16 2.92,30.61 3.32,31 4.97,31 5.72,31.75 v2(10.54,31.75) ; NOREF#3.65 16.38,37.21 v2(14.99,35.81)
  Bottom Layer w0.254: v2(14.99,35.81) 10.92,31.75 v2(10.54,31.75)
SWDIO: length 39.3
  Top Layer w0.254: U5.32 2.89,41.15 5.72,41.15 10.03,36.83 13.08,36.83 13.84,37.59 NOREF#4.65 ; 10.88,25.23 9.95,26.16 v2(9.27,26.16)
  Bottom Layer w0.254: v2(9.27,26.16) 9.27,36.45 7.11,38.61 2.16,38.61 1.65,39.12 U5.32
$1N2509: length 2.4
  Top Layer w0.254: LED1.2 34.45,38.18 R2.2

## Copper pours and planes (outline as drawn; the poured copper is in the pictures)
GND on Top Layer: 22.82,12.28 21.59,11.05 21.59,7.37 22.99,5.97 27.81,5.97 27.94,6.1 27.94,9.02 27.51,9.45 27.38,9.45 27.38,10.49 29.08,12.19 29.08,14.22 27.69,15.62 25.15,15.62 22.82,13.3
GND on Top Layer: -1.27,42.8 42.42,42.8 42.42,-0.76 -1.27,-0.76
GND on Bottom Layer: 31.24,12.43 32.51,11.16 32.51,1.52 32.38,1.4 32.26,1.4 31.88,1.02 28.57,1.02 28.45,1.14 28.45,5.59 27.94,6.1 27.94,9.02 27.51,9.45 27.38,9.45 27.38,10.49 29.32,12.43
GND on Bottom Layer: -2.16,43.56 43.05,43.56 43.05,-1.78 -2.16,-1.78

Small or netless copper shapes (teardrops, artwork), in the pictures only: 220 on Top Layer, 108 on Bottom Layer

## Text on the board
Bottom Silkscreen Layer: C11 | D2 | B3 | B4 | B5 | B7 | B8 | A15 | C10 | B6 | B9 | DIO | C12 | A9 | A8 | C7 | C8 | C9 | A10 | B15 | A11 | B14 | B12 | B13 | A12 | CLK | C6 | C5 | B1 | B0 | A5 | A4 | B2 | B11 | C4 | A7 | A6 | A3 | B10 | GND | A0 | C1 | A2 | A1 | C3 | C2 | C0 | C15 | C14 | C13 | BOOT0 | vc
Top Silkscreen Layer: GND | DIO | CLK | VCC
